# EAGLE design max6675 (EAGLE 9.6.2)
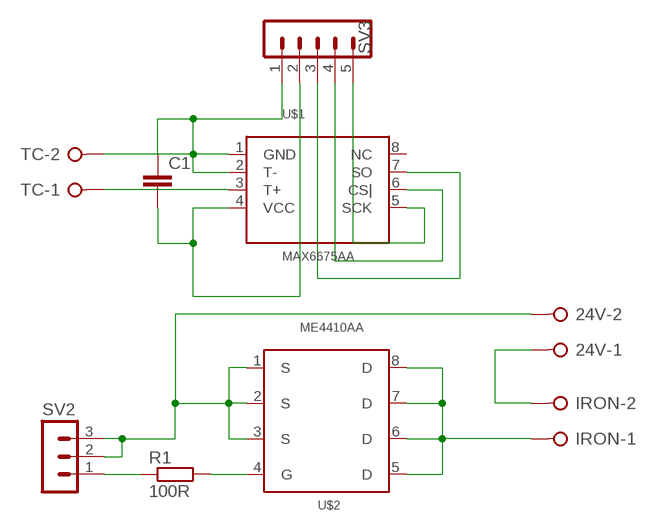
[diagram p0: schematic, sheet 1]

## Parts
24V  W237-02P  [W237-132]
C1  C-EU050-025X075  [C050-025X075]
IRON  W237-02P  [W237-132]
R1  100R  R-EU_M1206  [M1206]
SV2  MA03-1  [MA03-1]
SV3  MA05-1  [MA05-1]
TC  W237-02P  [W237-132]
U$1  MAX6675AA  [SO08]
U$2  ME4410AA  [SO-8]

## Nets
N$1: C1.1 SV3.1 TC.2 U$1.1(GND) U$1.2(T-)
N$2: TC.1 U$1.3(T+)
N$3: 24V.2 SV2.2 SV2.3 U$2.1(S) U$2.2(S) U$2.3(S)
N$4: C1.2 SV3.2 U$1.4(VCC)
N$5: SV3.5 U$1.5(SCK)
N$6: SV3.4 U$1.6(CS|)
N$7: SV3.3 U$1.7(SO)
N$8: IRON.1 U$2.5(D) U$2.6(D) U$2.7(D) U$2.8(D)
N$9: 24V.1 IRON.2
N$11: R1.2 U$2.4(G)
N$12: R1.1 SV2.1
Unconnected: U$1.8(NC)

## Library data of the parts
24V IRON TC = con-wago-508:W237-02P: WAGO SREW CLAMP; OC_FARNELL: unknown; OC_NEWARK: unknown
C1 = Cap:C-EU: CAPACITOR, European symbol; SPICEPREFIX: C
R1 = rcl:R-EU_: RESISTOR, European symbol; SPICEPREFIX: R
SV2 = con-lstb:MA03-1: PIN HEADER; OC_FARNELL: unknown; OC_NEWARK: unknown
SV3 = con-lstb:MA05-1: PIN HEADER; OC_FARNELL: unknown; OC_NEWARK: unknown
U$1 = MAX6675:MAX6675: MAX6675 MAXIM DEVICE SOIC8 0.150 PACKAGE
U$2 = ME4410A:ME4410A

## Board
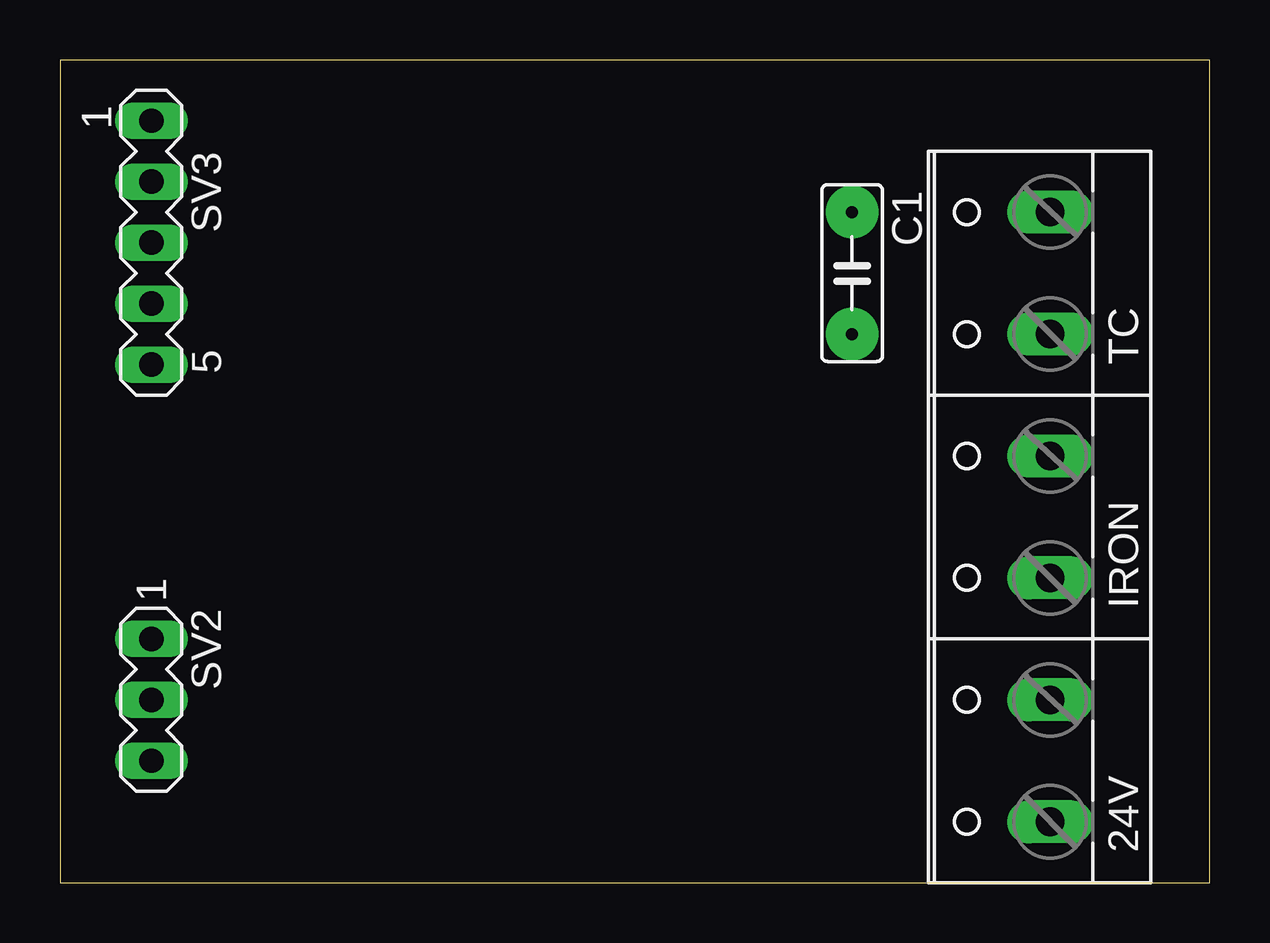
[diagram p1: board, top side]
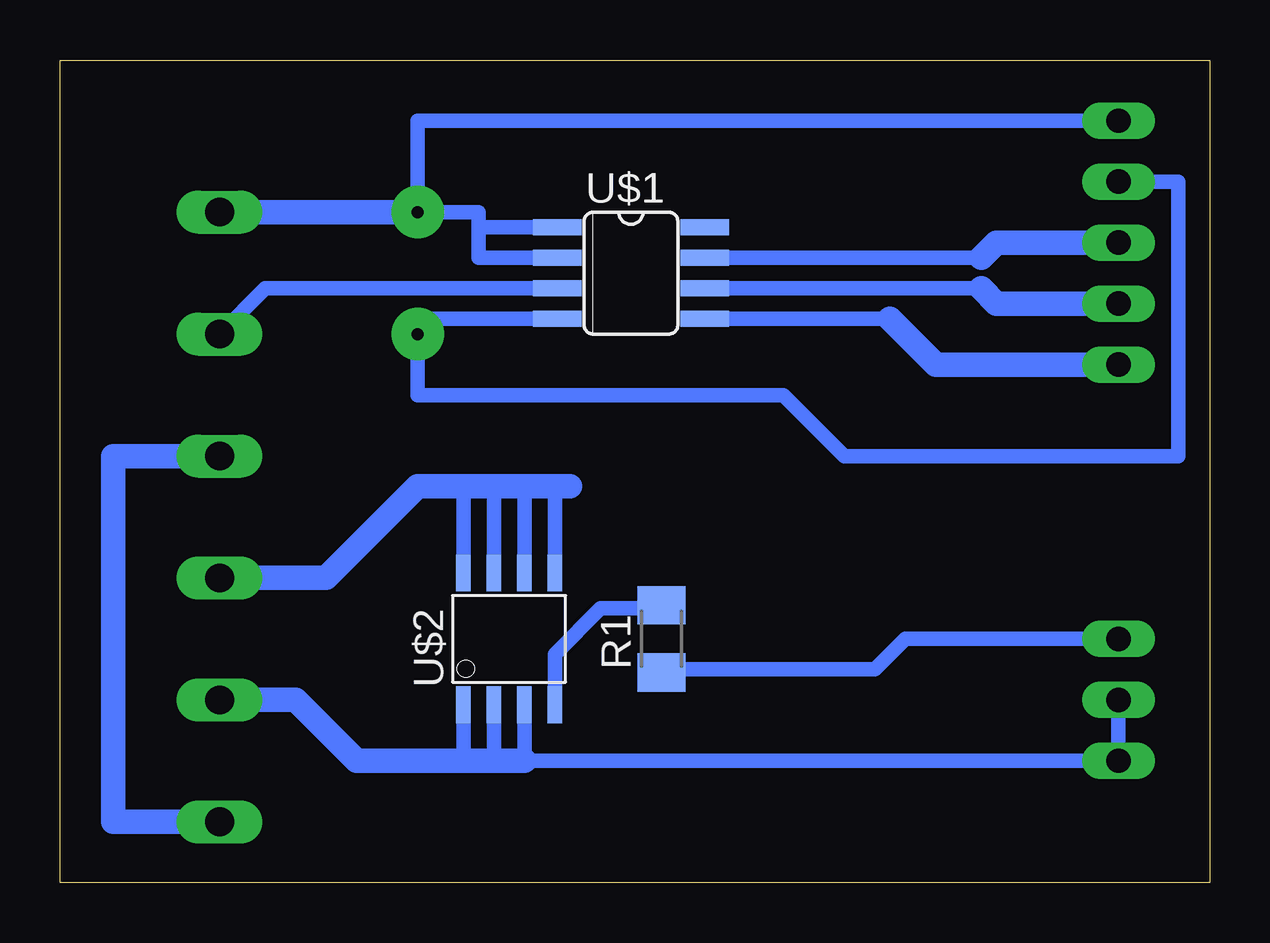
[diagram p2: board, bottom side, seen from below]

Size 47.93 x 34.28 mm. Coordinates in mm from the lower left corner, seen from the top.
Outline: 0,0 47.93,0 47.93,34.28 0,34.28 0,0
Copper layers (1*16): Top 0.035mm / dielectric 1.5mm / Bottom 0.035mm
Design rules "default": minimum track width 6mil, minimum drill 0.35mm, track to track 6mil, track to pad 6mil, pad to pad 6mil, via to via 6mil, smd to smd 6mil, copper to edge 40mil, drill to drill 6mil, minimum pad ring 10mil, minimum via ring 8mil, stop-mask expansion 4mil, vias tented up to drill 0mil, thermal gap 10mil

### Footprints (pad centres in the part's own frame; a part is rotated, then mirrored left to right if it is on the bottom)
W237-132 = drill 1.194 long: 1 -2.54,-0.635; 2 2.54,-0.635
C050-025X075 = drill 0.5 pad 2.184: 1 -2.54,0; 2 2.54,0
M1206 = smd 1.6 x 2: 1 -1.4,0; 2 1.4,0
MA03-1 = drill 1.016 long: 1 -2.54,0; 2 0,0; 3 2.54,0
MA05-1 = drill 1.016 long: 1 -5.08,0; 2 -2.54,0; 3 0,0; 4 2.54,0; 5 5.08,0
SO08 = smd 0.66 x 2.032: 1 -1.905,-3.073; 2 -0.635,-3.073; 3 0.635,-3.073; 4 1.905,-3.073; 5 1.905,3.073; 6 0.635,3.073; 7 -0.635,3.073; 8 -1.905,3.073
SO-8 = smd 1.524 x 0.61: 1 -2.743,1.905; 2 -2.743,0.635; 3 -2.743,-0.635; 4 -2.743,-1.905; 5 2.743,-1.905; 6 2.743,-0.635; 7 2.743,0.635; 8 2.743,1.905

### Placement (x,y rotation side)
24V  40.64,5.08 90 top
C1  33.02,25.4 270 top
IRON  40.64,15.24 90 top
R1  22.86,10.16 90 bottom
SV2  3.81,7.62 270 top
SV3  3.81,26.67 270 top
TC  40.64,25.4 90 top
U$1  24.13,25.4 270 bottom
U$2  29.21,10.16 90 bottom

### Tracks (layer width: path | path; a pad name or v marks a point on that pad's centre or on a via)
N$1
  Bottom 0.61: U$1.2 30.48,26.04 30.48,27.3 | 30.48,27.3 30.48,27.94 C1.1 33.02,31.75 SV3.1 | U$1.1 30.48,27.3
  Bottom 1.016: TC.2 C1.1
N$2
  Bottom 0.61: U$1.3 39.37,24.77 TC.1
N$3
  Bottom 0.61: U$2.3 28.57,5.08 SV2.3 SV2.2 | U$2.2 29.84,5.08 29.21,5.08 | U$2.1 31.11,5.08 30.48,5.08
  Bottom 1.016: 24V.2 38.1,7.62 35.56,5.08 30.48,5.08 29.21,5.08 28.57,5.08
N$4
  Bottom 0.61: U$1.4 32.38,23.5 C1.2 33.02,20.32 17.78,20.32 15.24,17.78 1.32,17.78 1.32,29.21 SV3.2
N$5
  Bottom 0.61: U$1.5 13.34,23.5
  Bottom 1.016: 13.34,23.5 11.43,21.59 SV3.5
N$6
  Bottom 0.61: U$1.6 9.53,24.77
  Bottom 1.016: 9.53,24.77 8.89,24.13 SV3.4
N$7
  Bottom 0.61: U$1.7 9.53,26.04
  Bottom 1.016: 9.53,26.04 8.89,26.67 SV3.3
N$8
  Bottom 0.61: U$2.5 27.3,16.51 27.94,16.51 | U$2.6 28.57,16.51 29.21,16.51 | U$2.7 29.84,16.51 30.48,16.51 | U$2.8 31.11,16.51 31.75,16.51
  Bottom 1.016: IRON.1 36.83,12.7 33.02,16.51 31.75,16.51 30.48,16.51 29.21,16.51 27.94,16.51 26.67,16.51
N$9
  Bottom 1.016: IRON.2 45.72,17.78 45.72,2.54 24V.1
N$11
  Bottom 0.61: R1.2 22.99,11.43 25.4,11.43 27.3,9.53 U$2.4
N$12
  Bottom 0.61: SV2.1 12.7,10.16 13.97,8.89 22.86,8.89 R1.1